# EasyEDA Pro project 转接板.eprj

# Schematic Schematic1
Create Date: 2023-04-12; Page Name: P1; Project Name: tu连接板（1）; Schematic Name: Schematic1; Update Date: 2023-04-12; Company: 嘉立创EDA; Page Size: A4; Version: V1.0
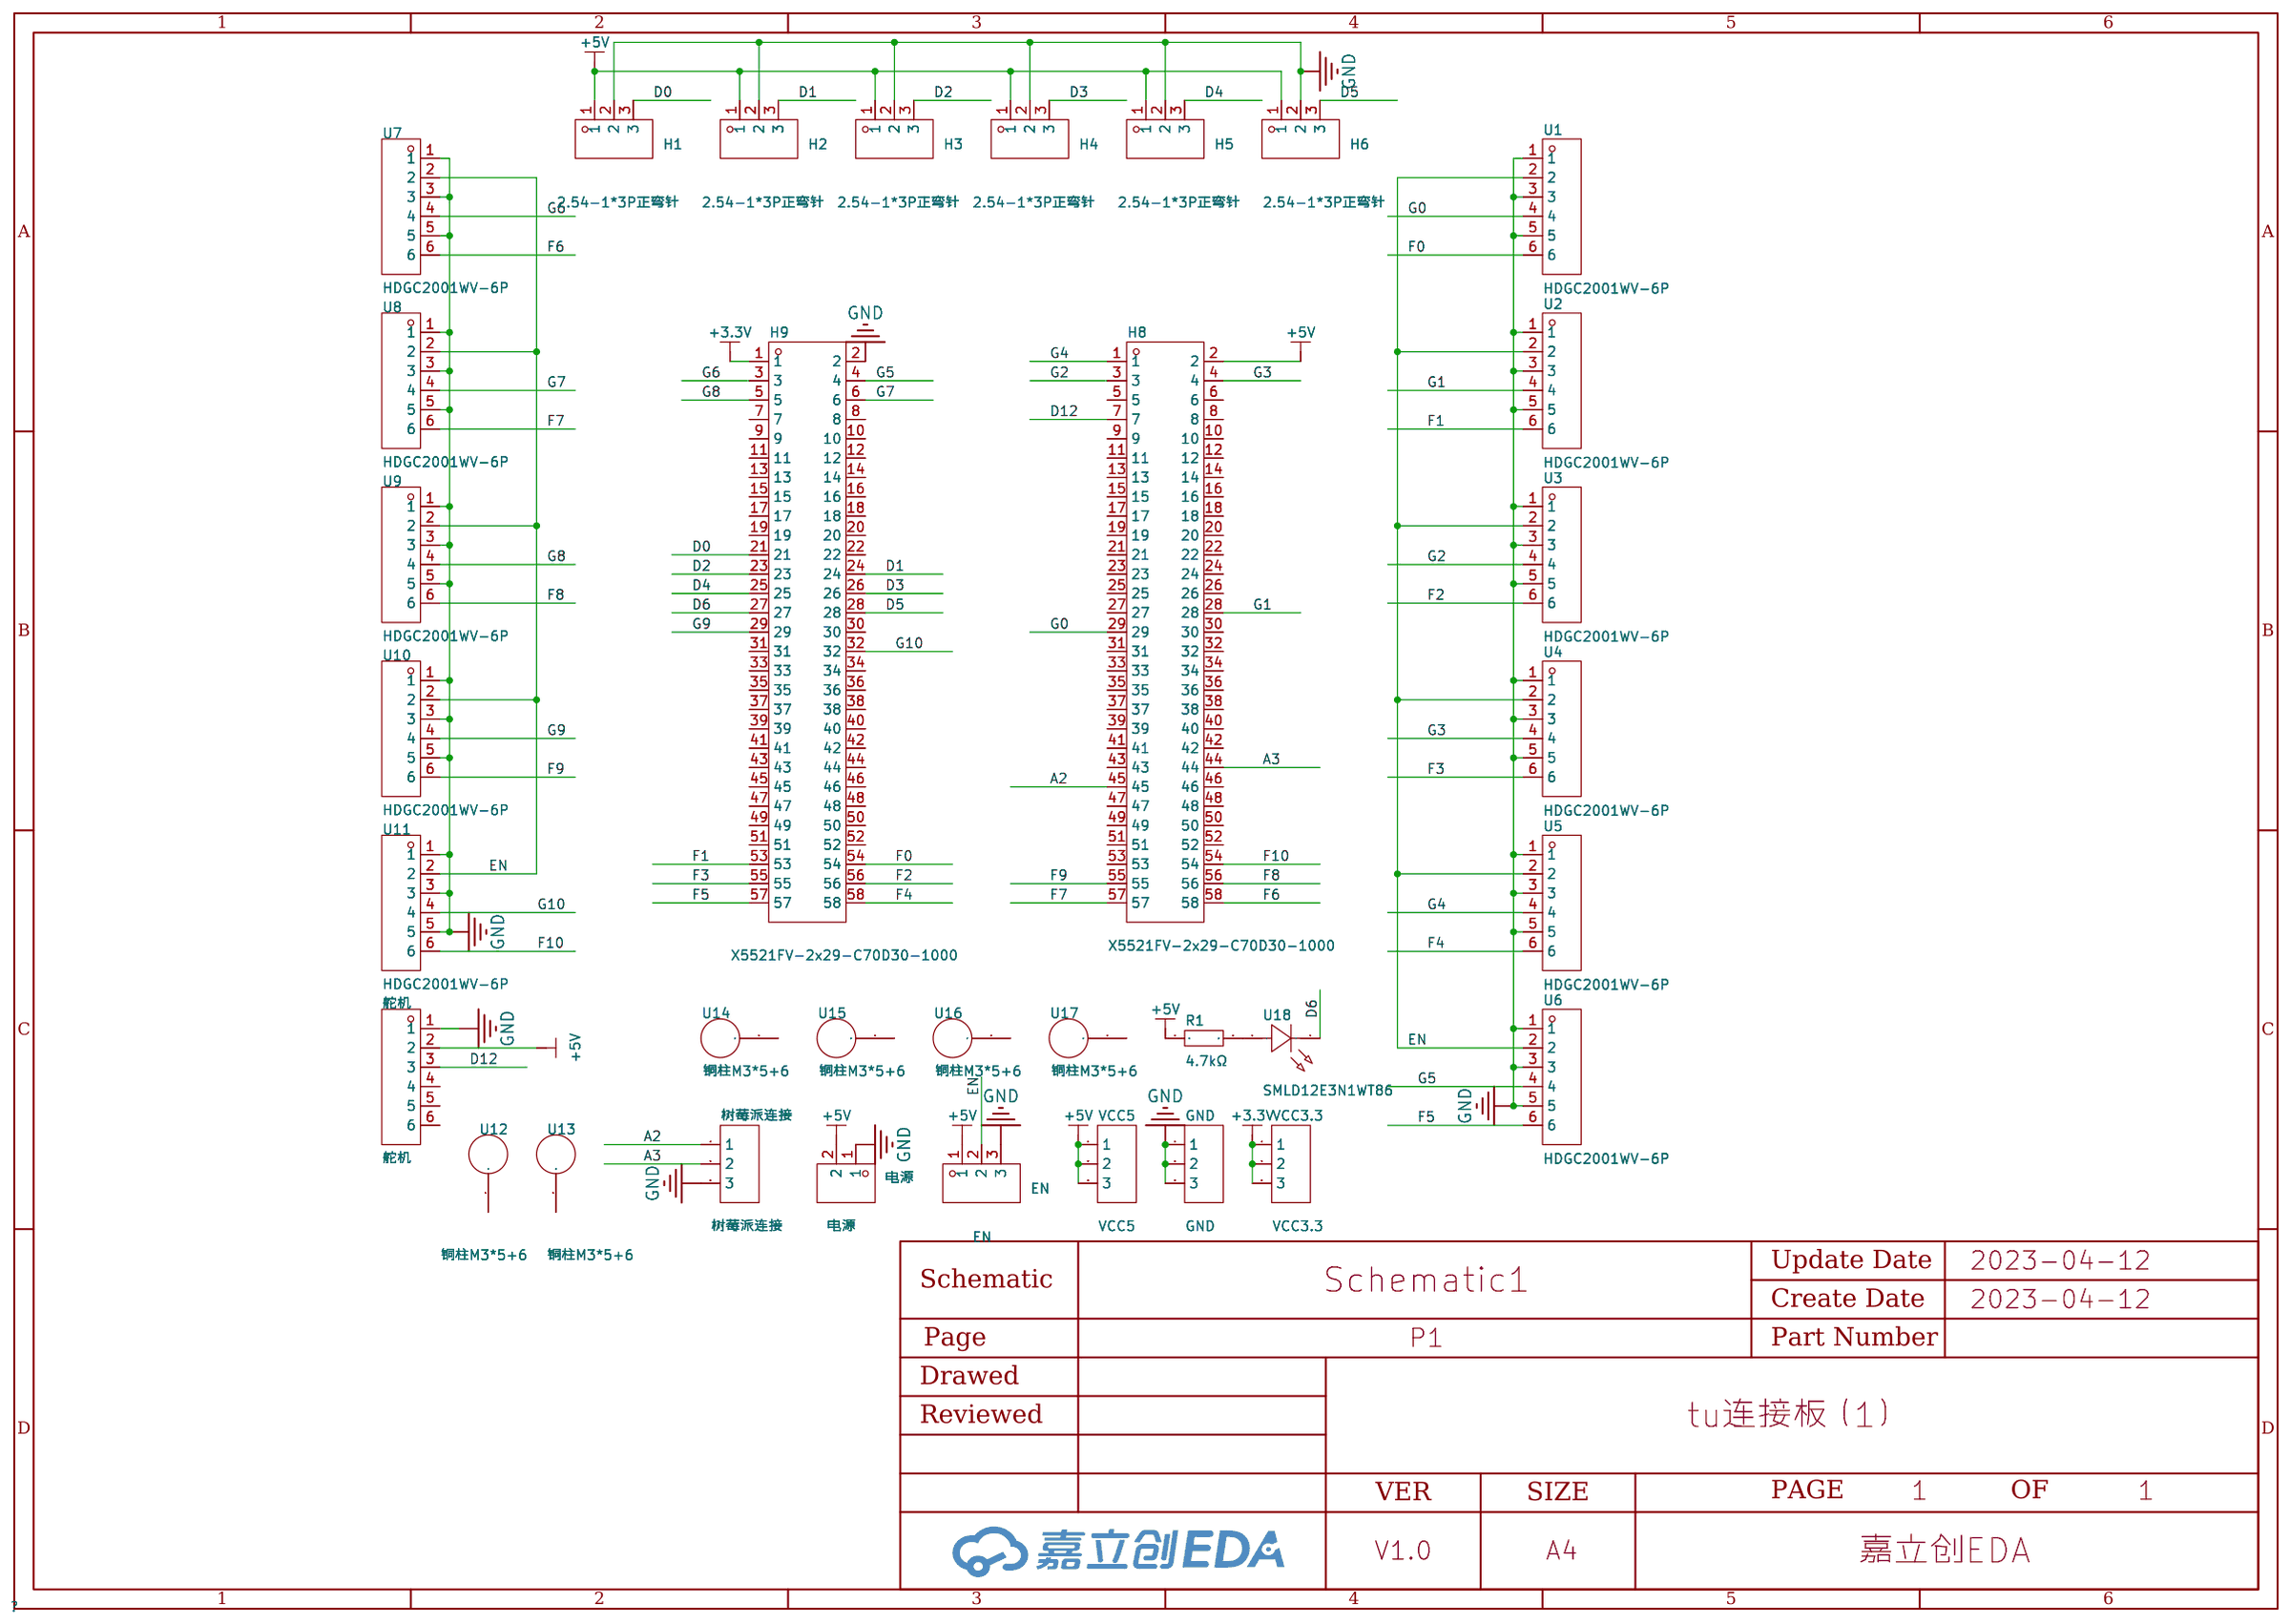
[diagram p0: schematic sheet]

## Parts
EN  EN  [HDR-TH_3P-P2.54-H-M-BW7.2-P]
GND  GND  [HDR-TH_3P-P2.54-V-M-1]
H1  2.54-1*3P正弯针  [HDR-TH_3P-P2.54-H-M-BW7.2-P]
H2  2.54-1*3P正弯针  [HDR-TH_3P-P2.54-H-M-BW7.2-P]
H3  2.54-1*3P正弯针  [HDR-TH_3P-P2.54-H-M-BW7.2-P]
H4  2.54-1*3P正弯针  [HDR-TH_3P-P2.54-H-M-BW7.2-P]
H5  2.54-1*3P正弯针  [HDR-TH_3P-P2.54-H-M-BW7.2-P]
H6  2.54-1*3P正弯针  [HDR-TH_3P-P2.54-H-M-BW7.2-P]
H8  X5521FV-2x29-C70D30-1000  [HDR-TH_58P-P2.54-V-F-R2-C29-S2.54]
H9  X5521FV-2x29-C70D30-1000  [HDR-TH_58P-P2.54-V-F-R2-C29-S2.54]
R1  4.7kΩ  [R0603]
U1  HDGC2001WV-6P  [CONN-TH_6P-P2.00_HDGC_HDGC2001WR-6P]
U2  HDGC2001WV-6P  [CONN-TH_6P-P2.00_HDGC_HDGC2001WR-6P]
U3  HDGC2001WV-6P  [CONN-TH_6P-P2.00_HDGC_HDGC2001WR-6P]
U4  HDGC2001WV-6P  [CONN-TH_6P-P2.00_HDGC_HDGC2001WR-6P]
U5  HDGC2001WV-6P  [CONN-TH_6P-P2.00_HDGC_HDGC2001WR-6P]
U6  HDGC2001WV-6P  [CONN-TH_6P-P2.00_HDGC_HDGC2001WR-6P]
U7  HDGC2001WV-6P  [CONN-TH_6P-P2.00_HDGC_HDGC2001WR-6P]
U8  HDGC2001WV-6P  [CONN-TH_6P-P2.00_HDGC_HDGC2001WR-6P]
U9  HDGC2001WV-6P  [CONN-TH_6P-P2.00_HDGC_HDGC2001WR-6P]
U10  HDGC2001WV-6P  [CONN-TH_6P-P2.00_HDGC_HDGC2001WR-6P]
U11  HDGC2001WV-6P  [CONN-TH_6P-P2.00_HDGC_HDGC2001WR-6P]
U12  铜柱M3*5+6  [SMD_BD4.2-L4.7-W4.7-D3.0]
U13  铜柱M3*5+6  [SMD_BD4.2-L4.7-W4.7-D3.0]
U14  铜柱M3*5+6  [SMD_BD4.2-L4.7-W4.7-D3.0]
U15  铜柱M3*5+6  [SMD_BD4.2-L4.7-W4.7-D3.0]
U16  铜柱M3*5+6  [SMD_BD4.2-L4.7-W4.7-D3.0]
U17  铜柱M3*5+6  [SMD_BD4.2-L4.7-W4.7-D3.0]
U18  SMLD12E3N1WT86  [LED-SMD_L1.6-W0.8-RD]
VCC3.3  VCC3.3  [HDR-TH_3P-P2.54-V-M-1]
VCC5  VCC5  [HDR-TH_3P-P2.54-V-M-1]
树莓派连接  树莓派连接  [HDR-TH_3P-P2.54-V-M-1]
电源  电源  [CONN-TH_2P-P2.00_HDGC2001WR-2P]
舵机  舵机  [CONN-TH_6P-P2.00_HDGC_HDGC2001WR-6P]

## Library data of the parts
EN H1-H6 = 2.54-1*3P正弯针: 间距:2.54mm;总PIN位数:3;排数:1;插针结构:1x3P;行距:-;安装类型:弯插;圆针/方针:方针;额定电流:3A;额定电压:-;配合针长度:3mm;塑高:2.54mm;端接针长度:-;触头材质:-;触头镀层:-;工作温度范围:-55~+105;颜色:黑色;; LCSC Part Name: 2.54mm 1x3P 弯插 方针; Supplier Part: C92159; Manufacturer: BOOMELE(博穆精密); Supplier Footprint: 插件,P=2.54mm; JLCPCB Part Class: 扩展库; Datasheet: https://atta.szlcsc.com/upload/public/pdf/source/20181121/C2334_B051029C4931EB562F9DCCAAD18AC88A.pdf; Supplier: LCSC; Pitch: 2.54mm; Number of Pins: 3; Number of Rows: 1; Pin Structure: 1x3P; Mounting Type: 弯插; Circluar Pins/Square Pins: 方针; Current Rating (Max): 3A; Length of Mating Pin: 3mm; Insulation Height: 2.54mm; Operating Temperature Range: -55~+105; Color: 黑色
GND VCC3.3 VCC5 树莓派连接 = 2.54-1*3P针: 排数:单排;总PIN位数:3;间距:2.54mm;插针结构:1x3P;行距:-;安装类型:直插;圆针/方针:方针;额定电流:3A;额定电压:-;配合针长度:-;塑高:-;端接针长度:-;触头材质:-;触头镀层:-;工作温度范围:-40~+105;颜色:黑色;; LCSC Part Name: 2.54mm 1x3P 直插 方针; Supplier Part: C49257; Manufacturer: BOOMELE(博穆精密); Supplier Footprint: 插件,P=2.54mm; JLCPCB Part Class: 扩展库; Datasheet: https://atta.szlcsc.com/upload/public/pdf/source/20221018/3E9408392E35E6F57A28985E5F7BF5C9.pdf; Supplier: LCSC; Number of Rows: 单排; Number of Pins: 3; Pitch: 2.54mm; Pin Structure: 1x3P; Mounting Type: 直插; Circluar Pins/Square Pins: 方针; Current Rating (Max): 3A; Operating Temperature Range: -40~+105; Color: 黑色
H8 H9 = X5521FV-2x29-C70D30-1000: 排数:双排;总孔位数:58;间距:2.54mm;插孔结构:2x29P;行距:2.54mm;安装类型:直插;圆孔/方孔:圆孔;额定电流:3A;额定电压:-;插孔方向:顶部;塑高:7mm;触头材质:黄铜;触头镀层:金;工作温度范围:-40~+105;焊接温度(最大值):260;; LCSC Part Name: 2.54mm 2x29P; Supplier Part: C2682213; Manufacturer: XKB Connectivity(中国星坤); Supplier Footprint: 直插,P=2.54mm; JLCPCB Part Class: 扩展库; Datasheet: https://atta.szlcsc.com/upload/public/pdf/source/20210108/C2682197_06F7869BD6CE28D3571C9D5993C38392.pdf; Supplier: LCSC; Number of Rows: 双排; Number of Holes: 58; Pitch: 2.54mm; Holes Structure: 2x29P; Row Spacing: 2.54mm; Mounting Type: 直插; Circular Hole / Square Hole: 圆孔; Current Rating (Max): 3A; Holes Direction: 顶部; Insulation Height: 7mm; Contact Material: 黄铜; Contact Plating: 金; Operating Temperature Range: -40~+105; Welding Temperature (Max): 260
R1 = 0603WAF1002T5E: 电阻类型:厚膜电阻;阻值:10kΩ;精度:±1%;功率:100mW;; LCSC Part Name: 10kΩ ±1% 100mW; Supplier Part: C25804; Manufacturer: UNI-ROYAL(厚声); Supplier Footprint: 0603; JLCPCB Part Class: Basic Part; Datasheet: https://atta.szlcsc.com/upload/public/pdf/source/20200306/C422600_1E6D84923E4A46A82E41ADD87F860B5C.pdf; Supplier: LCSC; Type: 厚膜电阻; Tolerance: ±1%; Power(Watts): 100mW; Temperature Coefficient: ±100ppm/; Overload Voltage (Max): 75V; Operating Temperature Range: -55~+155
U1-U11 舵机 = HDGC2001WV-6P: LCSC Part Name: PH2.0直针 6P; Supplier Part: C5175234; Manufacturer: HDGC(华德共创); Supplier Footprint: 插件,P=2mm; JLCPCB Part Class: 扩展库; Datasheet: https://atta.szlcsc.com/upload/public/pdf/source/20220916/C6875813FFA1039A4B3E585D63AEFA0D.pdf; Supplier: LCSC
U12-U17 = 铜柱M3*5+6: 螺柱类型:单通螺柱;公称直径:M3;螺距:-;长度:11mm;执行标准:-;强度等级:-;材料:-;表面处理:-;; Supplier Part: C87703; Manufacturer: 国产; Supplier Footprint: M3*5+6; JLCPCB Part Class: 扩展库; Supplier: LCSC; Bolts Type: 单通螺柱; Nominal Diameter: M3; Length: 11mm
U18 = SMLD12E3N1WT86: Supplier Part: C2846641; Manufacturer: ROHM(罗姆); JLCPCB Part Class: 扩展库; Datasheet: https://atta.szlcsc.com/upload/public/pdf/source/20220727/1D19B72BE1BFA79F3E6FBA74560F208D.pdf; Supplier: LCSC
电源 = XHB-2A: LCSC Part Name: 2P 2.5mm; Supplier Part: C2829622; Manufacturer: FG(富港); Supplier Footprint: 直插,P=2.5mm; JLCPCB Part Class: 扩展库; Supplier: LCSC

## Nets
+3.3V: H9.1 VCC3.3.1 VCC3.3.2 VCC3.3.3
+5V: EN.1 H1.1 H2.1 H3.1 H4.1 H5.1 H6.1 H8.2 R1.1 VCC5.1 VCC5.2 VCC5.3 电源.2 舵机.2
GND: EN.3 GND.1 GND.2 GND.3 H1.2 H2.2 H3.2 H4.2 H5.2 H6.2 H9.2 U1.1 U1.3 U1.5 U2.1 U2.3 U2.5 U3.1 U3.3 U3.5 U4.1 U4.3 U4.5 U5.1 U5.3 U5.5 U6.1 U6.3 U6.5 U7.1 U7.3 U7.5 U8.1 U8.3 U8.5 U9.1 U9.3 U9.5 U10.1 U10.3 U10.5 U11.1 U11.3 U11.5 树莓派连接.3 电源.1 舵机.1
A2: H8.45 树莓派连接.1
A3: H8.44 树莓派连接.2
D0: H1.3 H9.21
D1: H2.3 H9.24
D2: H3.3 H9.23
D3: H4.3 H9.26
D4: H5.3 H9.25
D5: H6.3 H9.28
D6: H9.27 U18.1(-)
D12: H8.7 舵机.3
EN: EN.2 U1.2 U2.2 U3.2 U4.2 U5.2 U6.2 U7.2 U8.2 U9.2 U10.2 U11.2
F0: H9.54 U1.6
F1: H9.53 U2.6
F2: H9.56 U3.6
F3: H9.55 U4.6
F4: H9.58 U5.6
F5: H9.57 U6.6
F6: H8.58 U7.6
F7: H8.57 U8.6
F8: H8.56 U9.6
F9: H8.55 U10.6
F10: H8.54 U11.6
G0: H8.29 U1.4
G1: H8.28 U2.4
G2: H8.3 U3.4
G3: H8.4 U4.4
G4: H8.1 U5.4
G5: H9.4 U6.4
G6: H9.3 U7.4
G7: H9.6 U8.4
G8: H9.5 U9.4
G9: H9.29 U10.4
G10: H9.32 U11.4
Net-(R1-2): R1.2 U18.2(+)

Not connected (* = marked no-connect by the designer): H8 5 6 8 9 10 11 12 13 14 15 16 17 18 19 20 21 22 23 24 25 26 27 30 31 32 33 34 35 36 37 38 39 40 41 42 43 46 47 48 49 50 51 52 53; H9 7 8 9 10 11 12 13 14 15 16 17 18 19 20 22 30 31 33 34 35 36 37 38 39 40 41 42 43 44 45 46 47 48 49 50 51 52; U12 1; U13 1; U14 1; U15 1; U16 1; U17 1; 舵机 4 5 6

# Board PCB1
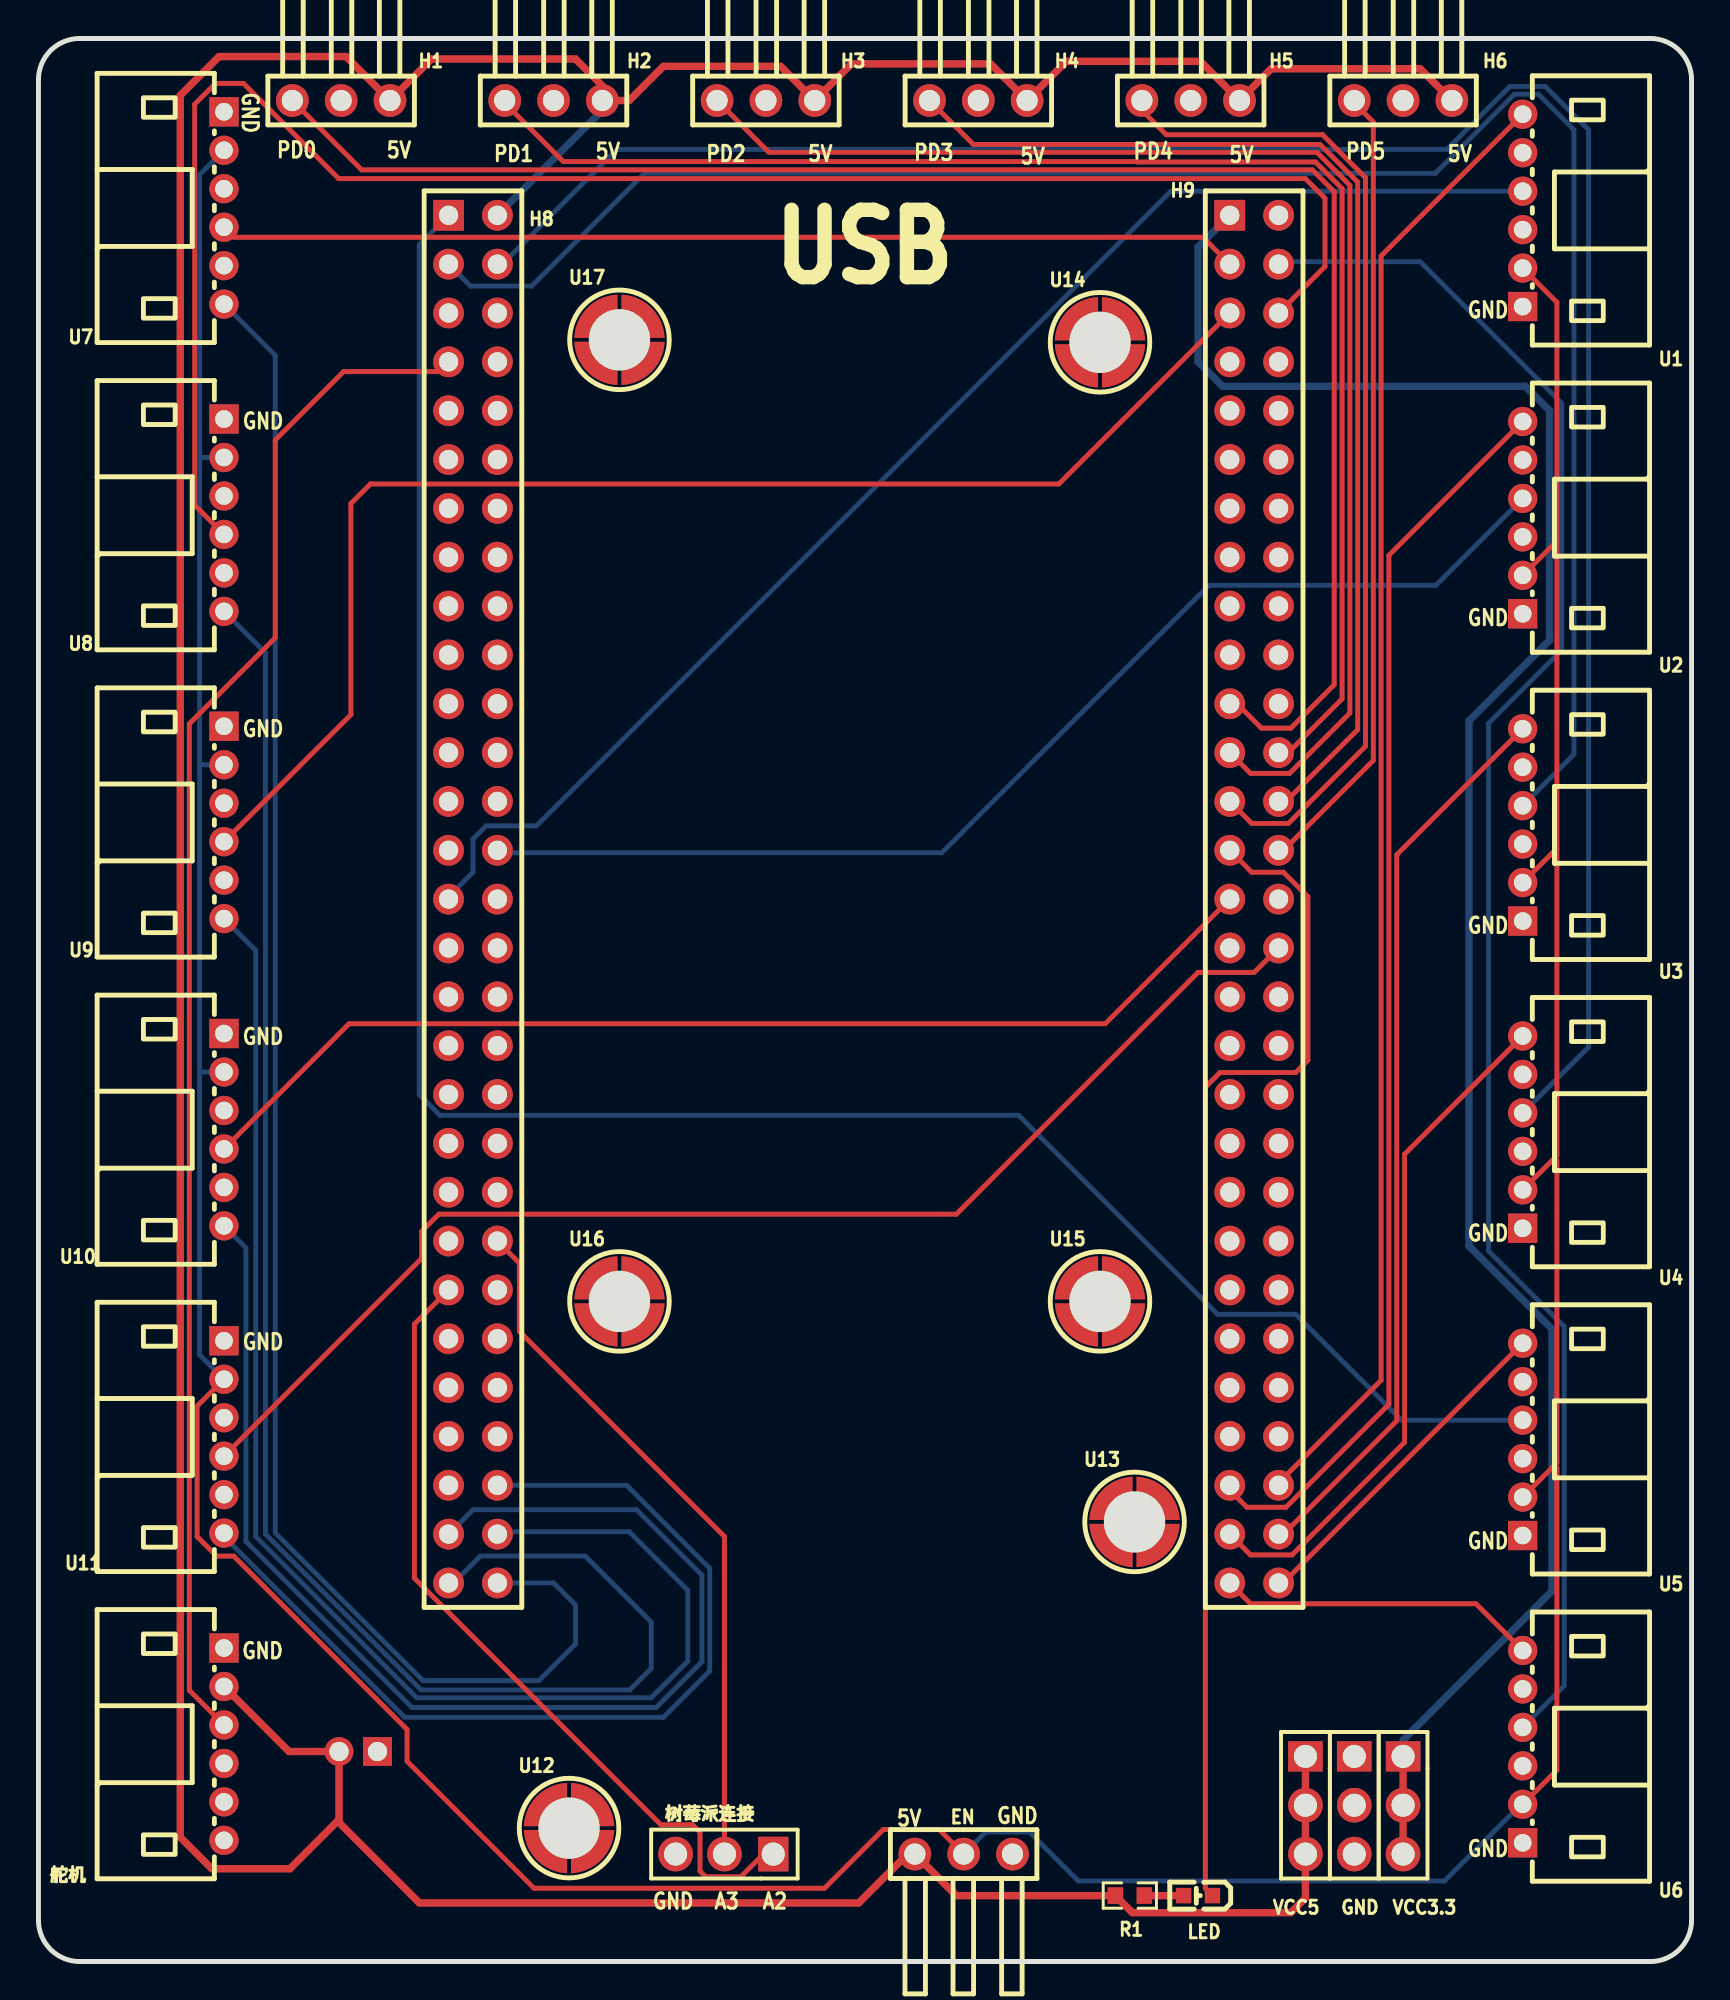
[diagram p1: board, top side]
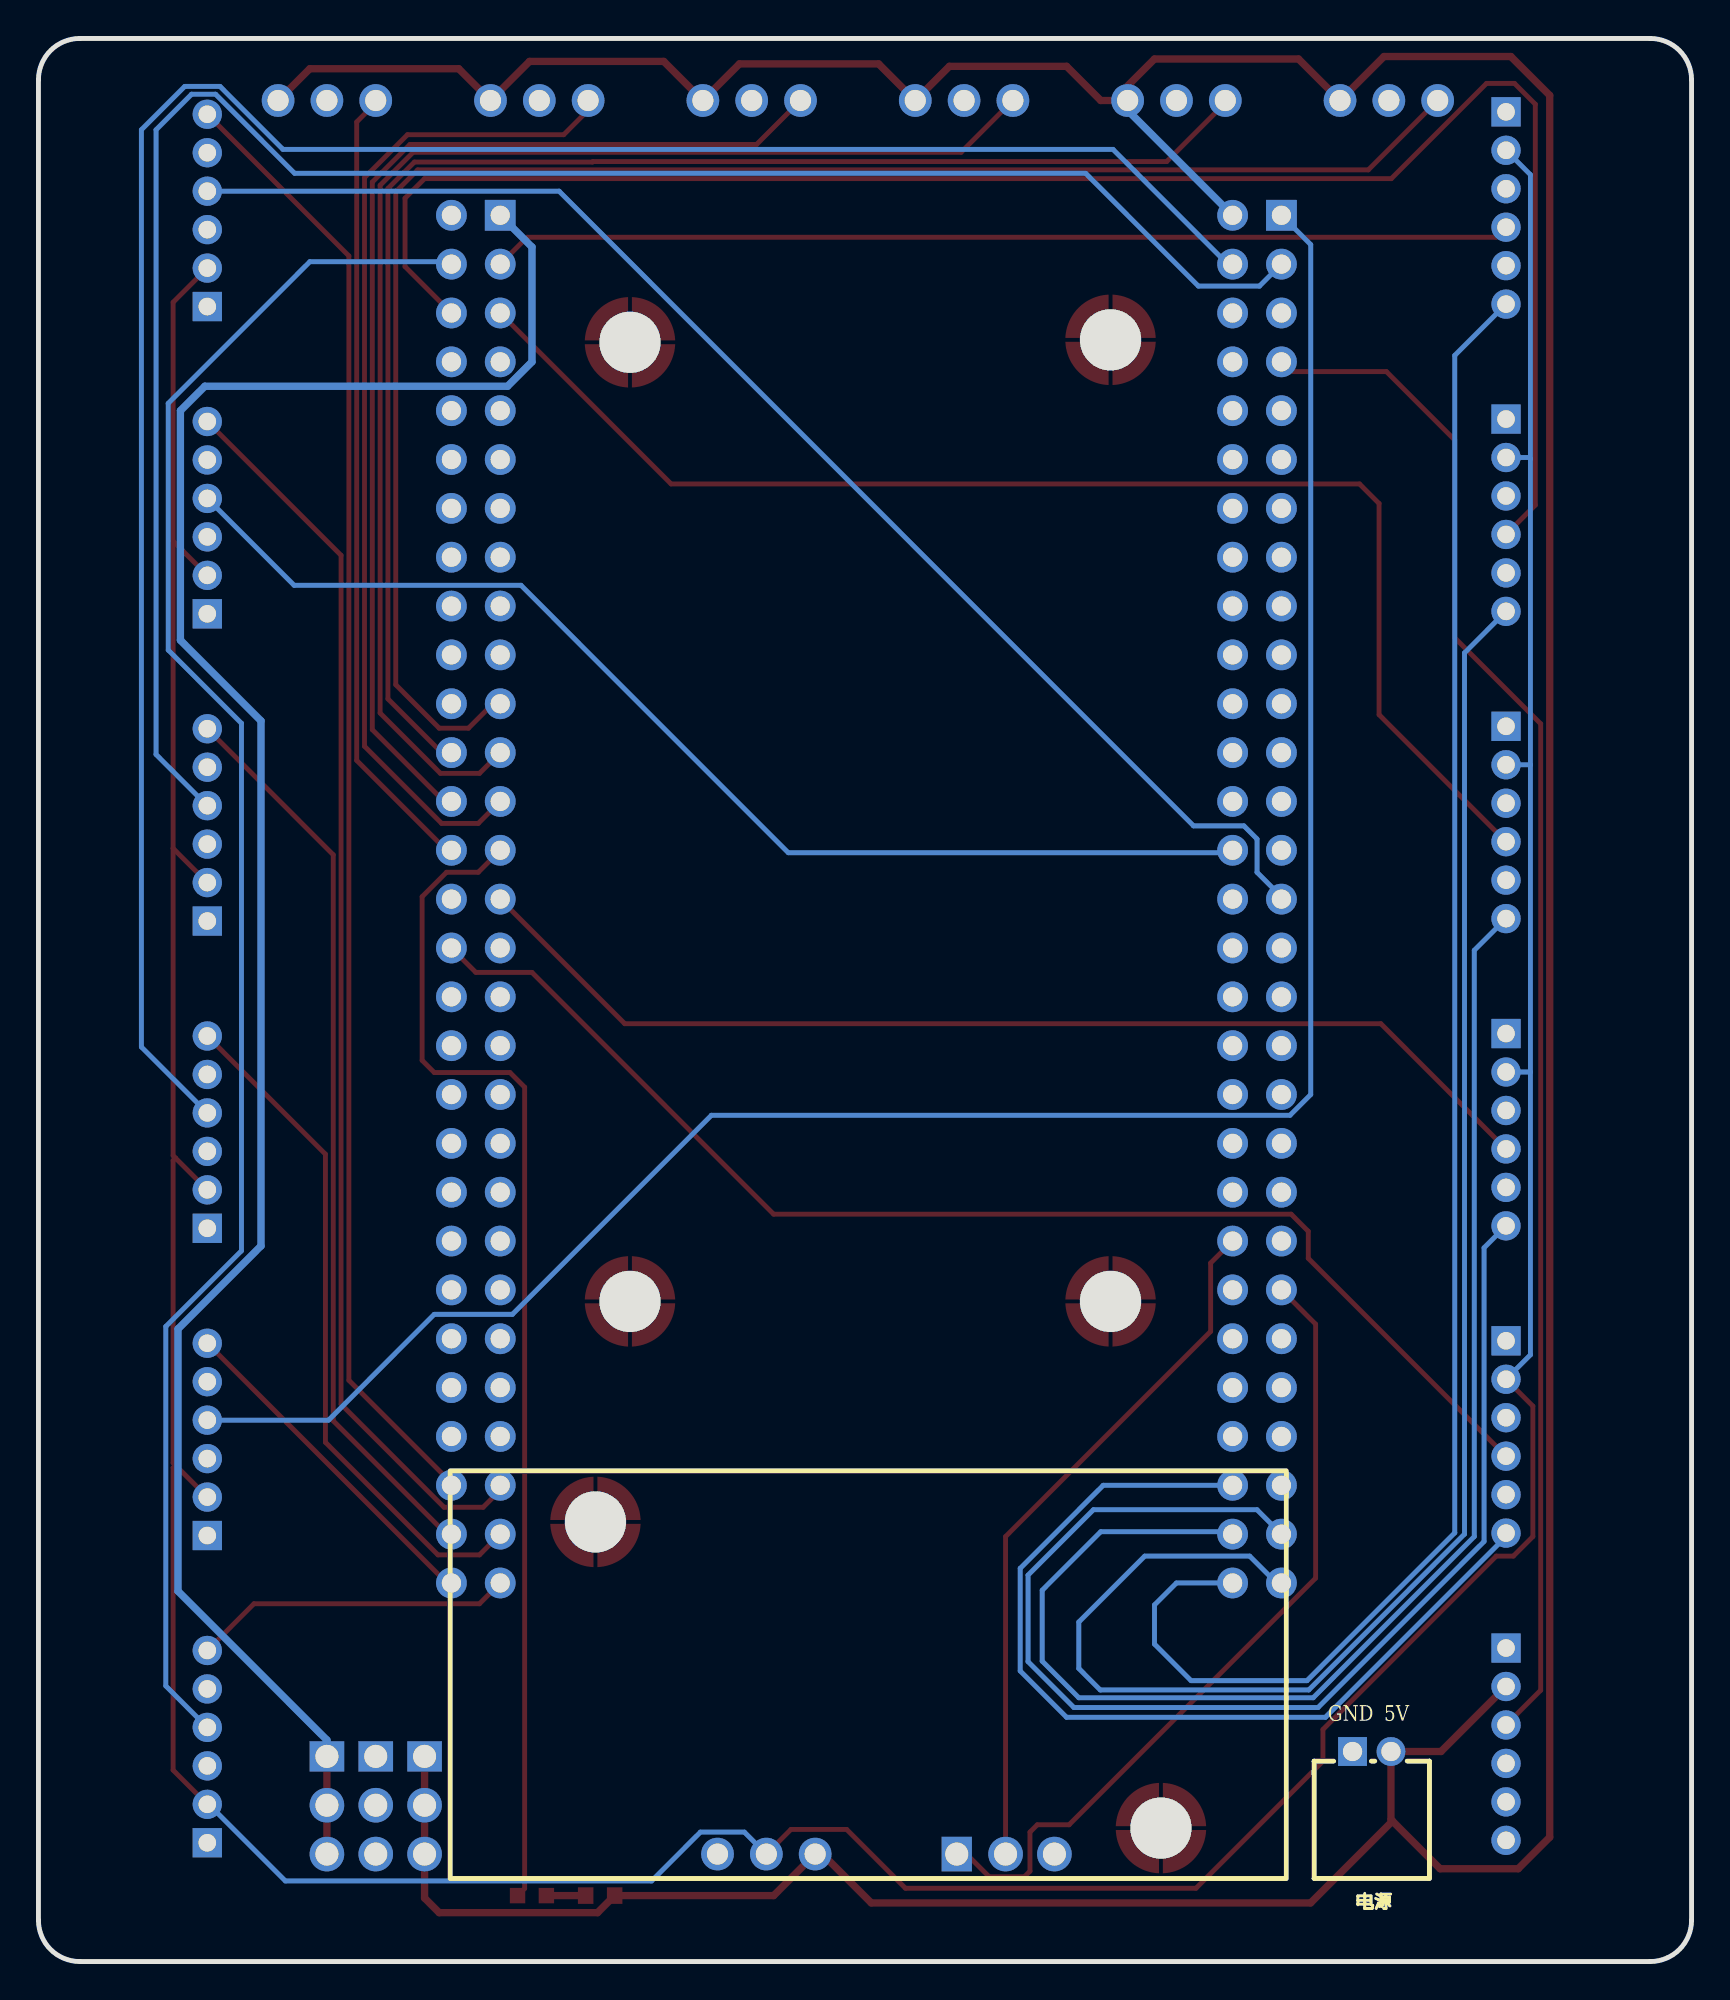
[diagram p2: board, bottom side, seen from below]

Outline 86 x 100 mm; copper layers: Top Layer, Bottom Layer. Coordinates in mm from the lower left corner of the outline.
Outline path: 0,97.85 0,2.15 arc(0.63,0.63) 2.15,0 83.85,0 arc(85.37,0.63) 86,2.15 86,97.85 arc(85.37,99.37) 83.85,100 2.15,100 arc(0.63,99.37) 0,97.85
Stack: Top Layer 0.035mm / Dielectric1 1.51mm FR4 er 4.5 / Bottom Layer 0.035mm

## Design rules (mm)
spacing safeClearance (default): track to track 0.152, other pairs 0.152 to 0.3
track width trackWidth (default): min 0.127, default 0.254, max 2.54
track width trackWidth1: min 0.127, default 0.381, max 2.54
differential pair differentialPair (default): width min 0.127, default 0.254, max 2.54; gap min 0.152, default 0.152
via viaSize (default): diameter min 0.5, default 0.61, max 10; hole min 0.3, default 0.305, max 6
net +5V uses trackWidth1
net +3.3V uses trackWidth1
net $1N28022 uses trackWidth1

## Placement (name value [footprint] x y rotation side)
EN  EN  [HDR-TH_3P-P2.54-H-M-BW7.2-P]  48.13 5.59 0 top
GND  GND  [HDR-TH_3P-P2.54-V-M-1]  68.45 8.13 270 top
H1  2.54-1*3P正弯针  [HDR-TH_3P-P2.54-H-M-BW7.2-P]  15.75 96.77 180 top
H2  2.54-1*3P正弯针  [HDR-TH_3P-P2.54-H-M-BW7.2-P]  26.8 96.77 180 top
H3  2.54-1*3P正弯针  [HDR-TH_3P-P2.54-H-M-BW7.2-P]  37.85 96.77 180 top
H4  2.54-1*3P正弯针  [HDR-TH_3P-P2.54-H-M-BW7.2-P]  48.9 96.77 180 top
H5  2.54-1*3P正弯针  [HDR-TH_3P-P2.54-H-M-BW7.2-P]  59.94 96.77 180 top
H6  2.54-1*3P正弯针  [HDR-TH_3P-P2.54-H-M-BW7.2-P]  70.99 96.77 180 top
H8  X5521FV-2x29-C70D30-1000  [HDR-TH_58P-P2.54-V-F-R2-C29-S2.54]  22.61 55.24 270 top
H9  X5521FV-2x29-C70D30-1000  [HDR-TH_58P-P2.54-V-F-R2-C29-S2.54]  63.25 55.24 270 top
LED  SMLD12E3N1WT86  [LED-SMD_L1.6-W0.8-RD]  60.32 3.43 180 top
R1  4.7kΩ  [R0603]  56.78 3.43 0 top
U1  HDGC2001WV-6P  [CONN-TH_6P-P2.00_HDGC_HDGC2001WR-6P]  77.22 91.06 90 top
U2  HDGC2001WV-6P  [CONN-TH_6P-P2.00_HDGC_HDGC2001WR-6P]  77.22 75.08 90 top
U3  HDGC2001WV-6P  [CONN-TH_6P-P2.00_HDGC_HDGC2001WR-6P]  77.22 59.11 90 top
U4  HDGC2001WV-6P  [CONN-TH_6P-P2.00_HDGC_HDGC2001WR-6P]  77.22 43.13 90 top
U5  HDGC2001WV-6P  [CONN-TH_6P-P2.00_HDGC_HDGC2001WR-6P]  77.22 27.15 90 top
U6  HDGC2001WV-6P  [CONN-TH_6P-P2.00_HDGC_HDGC2001WR-6P]  77.22 11.18 90 top
U7  HDGC2001WV-6P  [CONN-TH_6P-P2.00_HDGC_HDGC2001WR-6P]  9.65 91.19 270 top
U8  HDGC2001WV-6P  [CONN-TH_6P-P2.00_HDGC_HDGC2001WR-6P]  9.65 75.21 270 top
U9  HDGC2001WV-6P  [CONN-TH_6P-P2.00_HDGC_HDGC2001WR-6P]  9.65 59.23 270 top
U10  HDGC2001WV-6P  [CONN-TH_6P-P2.00_HDGC_HDGC2001WR-6P]  9.65 43.26 270 top
U11  HDGC2001WV-6P  [CONN-TH_6P-P2.00_HDGC_HDGC2001WR-6P]  9.65 27.28 270 top
U12  铜柱M3*5+6  [SMD_BD4.2-L4.7-W4.7-D3.0]  27.6 6.94 0 top
U13  铜柱M3*5+6  [SMD_BD4.2-L4.7-W4.7-D3.0]  57.02 22.86 0 top
U14  铜柱M3*5+6  [SMD_BD4.2-L4.7-W4.7-D3.0]  55.23 84.2 0 top
U15  铜柱M3*5+6  [SMD_BD4.2-L4.7-W4.7-D3.0]  55.23 34.33 0 top
U16  铜柱M3*5+6  [SMD_BD4.2-L4.7-W4.7-D3.0]  30.23 34.33 0 top
U17  铜柱M3*5+6  [SMD_BD4.2-L4.7-W4.7-D3.0]  30.23 84.33 0 top
VCC3.3  VCC3.3  [HDR-TH_3P-P2.54-V-M-1]  70.99 8.13 270 top
VCC5  VCC5  [HDR-TH_3P-P2.54-V-M-1]  65.91 8.13 270 top
树莓派连接  树莓派连接  [HDR-TH_3P-P2.54-V-M-1]  35.69 5.59 180 top
电源  电源  [CONN-TH_2P-P2.00_HDGC2001WR-2P]  16.64 10.92 180 bottom
舵机  舵机  [CONN-TH_6P-P2.00_HDGC_HDGC2001WR-6P]  9.65 11.3 270 top

## Footprints (pads in the part's own frame, mm; a bottom-side part is the same pattern mirrored in y, then rotated)
CONN-TH_2P-P2.00_HDGC2001WR-2P
  rect 1.5x1.5 hole 1: 1(-1,0)
  round 1.5 hole 1: 2(1,0)
CONN-TH_6P-P2.00_HDGC_HDGC2001WR-6P
  rect 1.524x1.524 hole 0.914: 1(-5,0)
  round 1.524 hole 0.914: 2(-3,0) 3(-1,0) 4(1,0) 5(3,0) 6(5,0)
HDR-TH_3P-P2.54-H-M-BW7.2-P
  round 1.7 hole 1.1: 1(-2.54,0) 2(0,0) 3(2.54,0)
HDR-TH_3P-P2.54-V-M-1
  rect 1.575x1.8 hole 1.2: 1(-2.54,0)
  round 1.8 hole 1.2: 2(0,0) 3(2.54,0)
HDR-TH_58P-P2.54-V-F-R2-C29-S2.54
  rect 1.6x1.6 hole 1: 1(-35.56,-1.27)
  round 1.6 hole 1: 2(-35.56,1.27) 3(-33.02,-1.27) 4(-33.02,1.27) 5(-30.48,-1.27) 6(-30.48,1.27) 7(-27.94,-1.27) 8(-27.94,1.27) 9(-25.4,-1.27) 10(-25.4,1.27) 11(-22.86,-1.27) 12(-22.86,1.27) 13(-20.32,-1.27) 14(-20.32,1.27) 15(-17.78,-1.27) 16(-17.78,1.27) 17(-15.24,-1.27) 18(-15.24,1.27) 19(-12.7,-1.27) 20(-12.7,1.27) 21(-10.16,-1.27) 22(-10.16,1.27) 23(-7.62,-1.27) 24(-7.62,1.27) 25(-5.08,-1.27) 26(-5.08,1.27) 27(-2.54,-1.27) 28(-2.54,1.27) 29(0,-1.27) 30(0,1.27) 31(2.54,-1.27) 32(2.54,1.27) 33(5.08,-1.27) 34(5.08,1.27) 35(7.62,-1.27) 36(7.62,1.27) 37(10.16,-1.27) 38(10.16,1.27) 39(12.7,-1.27) 40(12.7,1.27) 41(15.24,-1.27) 42(15.24,1.27) 43(17.78,-1.27) 44(17.78,1.27) 45(20.32,-1.27) 46(20.32,1.27) 47(22.86,-1.27) 48(22.86,1.27) 49(25.4,-1.27) 50(25.4,1.27) 51(27.94,-1.27) 52(27.94,1.27) 53(30.48,-1.27) 54(30.48,1.27) 55(33.02,-1.27) 56(33.02,1.27) 57(35.56,-1.27) 58(35.56,1.27)
LED-SMD_L1.6-W0.8-RD
  rect 0.8x0.8 smd: 1(-0.75,0) 2(0.75,0)
R0603
  rect 0.806x0.864 smd: 1(-0.753,0) 2(0.753,0)
SMD_BD4.2-L4.7-W4.7-D3.0
  custom 2.25x2.25 smd: 1(1.225,1.443) 2(1.225,-1.443) 3(-1.225,-1.442) 4(-1.225,1.443)

## Nets
As in the schematic, except:
D6: H9.27 LED.1
$1N28022: LED.2 R1.2

Pads without a net: H8 5 6 8 9 10 11 12 13 14 15 16 17 18 19 20 21 22 23 24 25 26 27 30 31 32 33 34 35 36 37 38 39 40 41 42 43 46 47 48 49 50 51 52 53; H9 7 8 9 10 11 12 13 14 15 16 17 18 19 20 22 30 31 33 34 35 36 37 38 39 40 41 42 43 44 45 46 47 48 49 50 51 52; U12 1 2 3 4; U13 1 2 3 4; U14 1 2 3 4; U15 1 2 3 4; U16 1 2 3 4; U17 1 2 3 4; 舵机 4 5 6

## Routing (per net, layer and track width the routed paths; a pad name or vN(x,y) marks a point on that pad's centre or on a via; arc(x,y) is an arc through that point)
+3.3V: length 109.4
  Top Layer w0.381: VCC3.3.1 VCC3.3.2 VCC3.3.3
  Bottom Layer w0.381: VCC3.3.1 70.99,11.52 78.74,19.26 78.74,32.89 74.42,37.21 74.42,64.52 78.61,68.71 78.61,80.64 77.34,81.91 61.59,81.91 60.32,83.18 60.32,89.15 H9.1
+5V: length 258.3
  Top Layer w0.381: 73.53,96.77 71.88,98.42 64.13,98.42 H5.1 60.45,98.81 53.47,98.81 H4.1 49.53,98.68 42.29,98.68 H3.1 38.61,98.55 32.51,98.55 30.73,96.77 29.71,96.77 ; 舵机.2 13.03,10.92 电源.2 15.64,7.38 15.56,7.3 ; 15.56,7.3 13.08,4.83 9.02,4.83 7.38,6.46 7.38,97.04 9.4,99.06 16,99.06 H1.1 20.45,98.93 27.94,98.93 29.71,97.16 29.71,96.77 ; 15.56,7.3 19.82,3.05 42.67,3.05 45.21,5.59 EN.1 47.75,3.43 R1.1 56.91,2.54 65.15,2.54 65.91,3.3 VCC5.3 VCC5.2 VCC5.1 ; 29.71,96.77 H2.1
  Bottom Layer w0.381: H2.1 29.34,96.27 H8.2
A2: length 42.5
  Top Layer w0.254: H8.45 19.56,33.15 19.56,19.94 32.38,7.11 34.04,7.11 34.42,6.73 34.42,4.7 34.71,4.41 36.54,4.41 37.72,5.59 树莓派连接.1
A3: length 36.8
  Top Layer w0.254: 树莓派连接.2 35.69,22.1 25.02,32.77 25.02,36.32 H8.44
D0: length 88.7
  Top Layer w0.254: H9.21 62.36,65.4 63.63,64.13 65.15,64.13 67.41,66.4 67.41,92.03 66.27,93.17 16.81,93.17 H1.3
D1: length 76.5
  Top Layer w0.254: H9.24 65.02,62.86 67.82,65.66 67.82,92.2 66.44,93.57 57.18,93.57 57.15,93.6 27.31,93.6 24.26,96.65 H2.3
D2: length 70.2
  Top Layer w0.254: H3.3 38,94.08 66.51,94.08 68.22,92.36 68.22,64.92 65.09,61.79 63.06,61.79 H9.23
D3: length 58.2
  Top Layer w0.254: 46.35,96.77 48.64,94.49 66.68,94.49 68.63,92.53 68.63,64.06 64.9,60.32 H9.26
D4: length 52.4
  Top Layer w0.254: H9.25 63.12,59.18 65.02,59.18 69.04,63.19 69.04,92.76 66.8,95 58.67,95 57.4,96.27 H5.3
D5: length 41.6
  Top Layer w0.254: H9.28 64.77,57.78 69.44,62.46 69.44,95.66 68.45,96.65 H6.3
D6: length 61.7
  Top Layer w0.254: LED.1 60.71,3.8 60.71,45.47 61.47,46.23 65.41,46.23 66.04,46.86 66.04,55.37 64.77,56.64 63.12,56.64 H9.27
D12: length 80.1
  Top Layer w0.254: H8.7 20.83,82.68 15.88,82.68 12.32,79.12 12.32,68.83 7.85,64.36 7.85,14.11 舵机.3
EN: length 251.3
  Top Layer w0.254: 78.87,25.8 78.99,25.68 78.99,9.95 U6.2 ; 78.87,25.8 78.99,25.93 78.99,41.65 78.87,41.78 ; 78.87,25.8 U5.2 ; 78.99,73.86 78.99,57.88 ; 78.99,73.86 U2.2 ; 78.99,73.86 78.99,86.28 U1.2 ; 78.99,57.88 U3.2 ; 78.99,57.88 78.99,41.91 78.87,41.78 ; 78.87,41.78 U4.2 ; U11.2 8.26,28.88 8.26,22.1 9.27,21.08 10.16,21.08 19.18,12.06 19.18,10.41 25.78,3.81 40.89,3.81 43.95,6.87 46.85,6.87 EN.2
  Bottom Layer w0.254: U7.2 8.38,92.92 8.38,78.15 ; U8.2 8.44,78.21 8.38,78.15 ; U6.2 77.14,8.18 73.15,4.19 54.1,4.19 51.56,6.73 49.28,6.73 EN.2 ; 8.38,46.26 8.38,31.55 U11.2 ; 8.38,46.26 U10.2 ; 8.38,46.26 8.38,62.23 ; 8.38,78.15 8.38,62.23 ; 8.38,62.23 U9.2
F0: length 76.6
  Top Layer w0.254: H9.54 64.52,24.89 69.85,30.23 69.85,88.69 U1.6
F1: length 65.1
  Top Layer w0.254: U2.6 70.26,73.12 70.26,28.98 64.9,23.62 62.87,23.62 61.98,24.51 H9.53
F2: length 47.3
  Top Layer w0.254: U3.6 70.66,57.55 70.66,28.12 64.77,22.22 H9.56
F3: length 35.6
  Top Layer w0.254: U4.6 71.07,41.98 71.07,27 65.21,21.15 63.06,21.15 H9.55
F4: length 17.9
  Top Layer w0.254: U5.6 64.88,19.81 64.64,19.81 H9.58
F5: length 16.7
  Top Layer w0.254: H9.57 63.06,18.61 74.79,18.61 U6.6
F6: length 91.2
  Bottom Layer w0.254: U7.6 12.32,83.52 12.32,22.29 20.01,14.6 26.03,14.6 27.94,16.51 27.94,18.54 26.8,19.68 H8.58
F7: length 87.8
  Bottom Layer w0.254: U8.6 11.81,68.05 11.81,22.22 19.91,14.12 30.76,14.12 31.88,15.24 31.88,17.65 28.45,21.08 22.99,21.08 21.46,19.56 H8.57
F8: length 74.5
  Bottom Layer w0.254: H8.56 24,22.35 30.73,22.35 33.78,19.3 33.78,15.62 31.88,13.72 19.69,13.72 11.3,22.1 11.3,52.58 U9.6
F9: length 64.8
  Bottom Layer w0.254: H8.55 22.61,23.49 31.12,23.49 34.52,20.09 34.52,15.6 32.13,13.21 19.43,13.21 10.8,21.84 10.8,37.11 U10.6
F10: length 48.5
  Bottom Layer w0.254: U11.6 9.65,22.1 19.05,12.7 32.51,12.7 34.93,15.11 34.93,20.45 30.61,24.76 H8.54
G0: length 72.2
  Bottom Layer w0.254: U1.4 58.91,92.06 25.91,59.05 23.29,59.05 22.61,58.37 22.61,56.64 21.34,55.37 H8.29
G1: length 61
  Bottom Layer w0.254: U2.4 72.7,71.56 60.9,71.56 46.99,57.66 24,57.66 H8.28
G2: length 100.2
  Bottom Layer w0.254: H8.3 22.48,87.12 25.65,87.12 31.52,92.99 72.67,92.99 76.78,97.1 78.03,97.1 79.88,95.25 79.88,62.77 U3.4
G3: length 114.1
  Bottom Layer w0.254: H8.4 24.13,88.26 30.1,94.23 73.28,94.23 76.55,97.51 78.39,97.51 80.65,95.25 80.65,47.56 U4.4
G4: length 110.8
  Bottom Layer w0.254: U5.4 70.91,28.15 65.41,33.65 61.34,33.65 50.99,44.01 20.89,44.01 19.81,45.08 19.81,89.28 H8.1
G5: length 90.8
  Bottom Layer w0.254: U6.4 79.38,14.33 79.38,33.02 75.44,36.96 75.44,64.39 79.25,68.2 79.25,81.03 71.88,88.39 64.64,88.39 H9.4
G6: length 53.1
  Top Layer w0.254: U7.4 10.18,89.66 60.58,89.66 H9.3
G7: length 91.7
  Top Layer w0.254: U8.4 8.13,75.73 8.13,96.58 9.21,97.66 10.67,97.66 15.62,92.71 65.91,92.71 66.93,91.69 66.93,88.14 H9.6
G8: length 70.1
  Top Layer w0.254: H9.5 53.09,76.83 17.27,76.83 16.26,75.82 16.26,64.84 U9.4
G9: length 57.7
  Top Layer w0.254: H9.29 55.5,48.77 16.16,48.77 U10.4
G10: length 66.6
  Top Layer w0.254: U11.4 19.94,36.57 19.94,37.97 20.83,38.86 47.75,38.86 60.32,51.43 63.25,51.43 H9.32
$1N28022: length 2
  Top Layer w0.381: R1.2 LED.2

## Text on the board
Bottom Silkscreen Layer: 5V | GND
Top Silkscreen Layer: GND | PD0 | 5V | PD1 | PD2 | A3 | A2 | PD3 | PD4 | PD5 | USB
